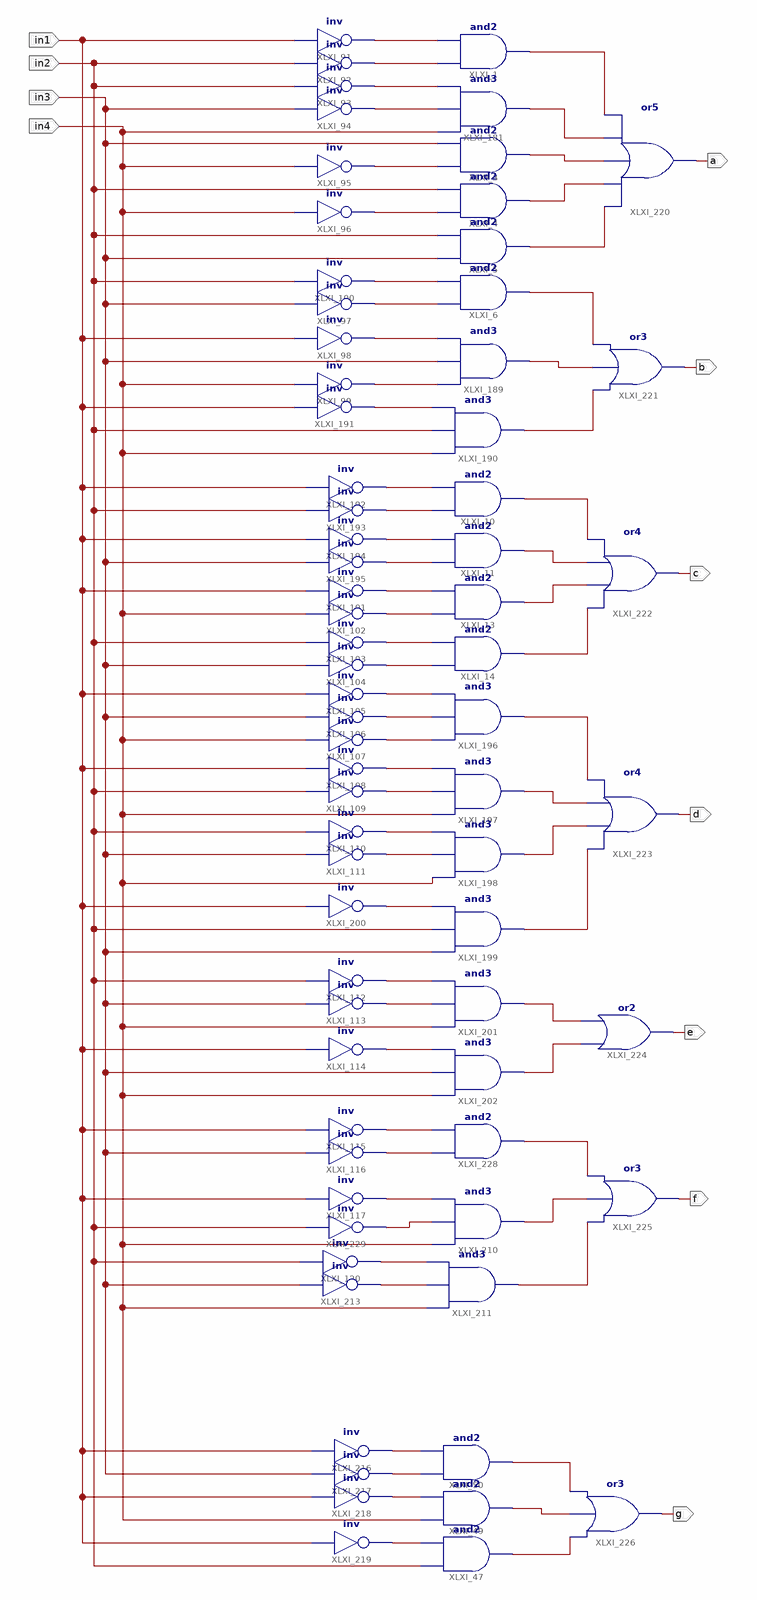
[diagram p0: schematic sheet 1]
// Xilinx ISE schematic Decoderto7segment2.sch (spartan6) as structural Verilog: 71 symbols, 11 ports
module Decoderto7segment2 (
  input  in1,
  input  in2,
  input  in3,
  input  in4,
  output a,
  output b,
  output c,
  output d,
  output e,
  output f,
  output g
);

  wire XLXN_1, XLXN_2, XLXN_3, XLXN_4, XLXN_5, XLXN_6, XLXN_7, XLXN_8, XLXN_9, XLXN_10, XLXN_11, XLXN_12,
       XLXN_13, XLXN_14, XLXN_16, XLXN_17, XLXN_18, XLXN_21, XLXN_22, XLXN_23, XLXN_24, XLXN_25, XLXN_26,
       XLXN_27, XLXN_28, XLXN_29, XLXN_32, XLXN_33, XLXN_34, XLXN_35, XLXN_36, XLXN_37, XLXN_38, XLXN_41,
       XLXN_42, XLXN_45, XLXN_46, XLXN_47, XLXN_48, XLXN_53, XLXN_54, XLXN_55, XLXN_56, XLXN_57, XLXN_59,
       XLXN_60, XLXN_61, XLXN_62, XLXN_63, XLXN_64, XLXN_65, XLXN_66, XLXN_67, XLXN_68, XLXN_69, XLXN_70,
       XLXN_71, XLXN_72, XLXN_73, XLXN_74, XLXN_81, XLXN_82, XLXN_83, XLXN_84;

  and XLXI_1 (XLXN_53, XLXN_2, XLXN_1);
  and XLXI_3 (XLXN_55, XLXN_5, in3);
  and XLXI_4 (XLXN_56, XLXN_6, in2);
  and XLXI_5 (XLXN_57, in3, in2);
  and XLXI_6 (XLXN_59, XLXN_8, XLXN_7);
  and XLXI_10 (XLXN_62, XLXN_13, XLXN_12);
  and XLXI_11 (XLXN_63, XLXN_16, XLXN_14);
  and XLXI_13 (XLXN_64, XLXN_18, XLXN_17);
  and XLXI_14 (XLXN_65, XLXN_22, XLXN_21);
  and XLXI_47 (XLXN_84, in2, XLXN_48);
  and XLXI_49 (XLXN_83, in4, XLXN_47);
  and XLXI_50 (XLXN_82, XLXN_46, XLXN_45);
  not XLXI_101 (XLXN_17, in1);
  not XLXI_102 (XLXN_18, in4);
  not XLXI_103 (XLXN_21, in2);
  not XLXI_104 (XLXN_22, in3);
  not XLXI_105 (XLXN_23, in1);
  not XLXI_106 (XLXN_24, in3);
  not XLXI_107 (XLXN_25, in4);
  not XLXI_108 (XLXN_26, in1);
  not XLXI_109 (XLXN_27, in2);
  not XLXI_110 (XLXN_28, in2);
  not XLXI_111 (XLXN_29, in3);
  not XLXI_112 (XLXN_33, in2);
  not XLXI_113 (XLXN_34, in3);
  not XLXI_114 (XLXN_35, in1);
  not XLXI_91 (XLXN_1, in1);
  not XLXI_92 (XLXN_2, in2);
  not XLXI_93 (XLXN_3, in2);
  not XLXI_94 (XLXN_4, in3);
  not XLXI_95 (XLXN_5, in4);
  not XLXI_96 (XLXN_6, in4);
  and XLXI_181 (XLXN_54, in4, XLXN_4, XLXN_3);
  not XLXI_100 (XLXN_7, in2);
  not XLXI_97 (XLXN_8, in3);
  not XLXI_98 (XLXN_9, in1);
  not XLXI_99 (XLXN_10, in4);
  and XLXI_189 (XLXN_60, XLXN_10, in3, XLXN_9);
  and XLXI_190 (XLXN_61, in4, in2, XLXN_11);
  not XLXI_191 (XLXN_11, in1);
  not XLXI_192 (XLXN_12, in1);
  not XLXI_193 (XLXN_13, in2);
  not XLXI_194 (XLXN_14, in1);
  not XLXI_195 (XLXN_16, in3);
  and XLXI_196 (XLXN_66, XLXN_25, XLXN_24, XLXN_23);
  and XLXI_197 (XLXN_67, in4, XLXN_27, XLXN_26);
  and XLXI_198 (XLXN_68, in4, XLXN_29, XLXN_28);
  and XLXI_199 (XLXN_69, in3, in2, XLXN_32);
  not XLXI_200 (XLXN_32, in1);
  and XLXI_201 (XLXN_70, in4, XLXN_34, XLXN_33);
  and XLXI_202 (XLXN_71, in4, in3, XLXN_35);
  not XLXI_115 (XLXN_36, in1);
  not XLXI_116 (XLXN_37, in3);
  not XLXI_117 (XLXN_38, in1);
  not XLXI_120 (XLXN_41, in2);
  and XLXI_210 (XLXN_73, in4, XLXN_81, XLXN_38);
  and XLXI_211 (XLXN_74, in4, XLXN_42, XLXN_41);
  not XLXI_213 (XLXN_42, in3);
  not XLXI_216 (XLXN_45, in1);
  not XLXI_217 (XLXN_46, in3);
  not XLXI_218 (XLXN_47, in1);
  not XLXI_219 (XLXN_48, in1);
  or XLXI_220 (a, XLXN_57, XLXN_56, XLXN_55, XLXN_54, XLXN_53);
  or XLXI_221 (b, XLXN_61, XLXN_60, XLXN_59);
  or XLXI_222 (c, XLXN_65, XLXN_64, XLXN_63, XLXN_62);
  or XLXI_223 (d, XLXN_69, XLXN_68, XLXN_67, XLXN_66);
  or XLXI_224 (e, XLXN_71, XLXN_70);
  or XLXI_225 (f, XLXN_74, XLXN_73, XLXN_72);
  or XLXI_226 (g, XLXN_84, XLXN_83, XLXN_82);
  and XLXI_228 (XLXN_72, XLXN_37, XLXN_36);
  not XLXI_229 (XLXN_81, in2);
endmodule
